# EAGLE design 8_button_harvester (EAGLE 9.5.1)

## Sheet 1 of 2
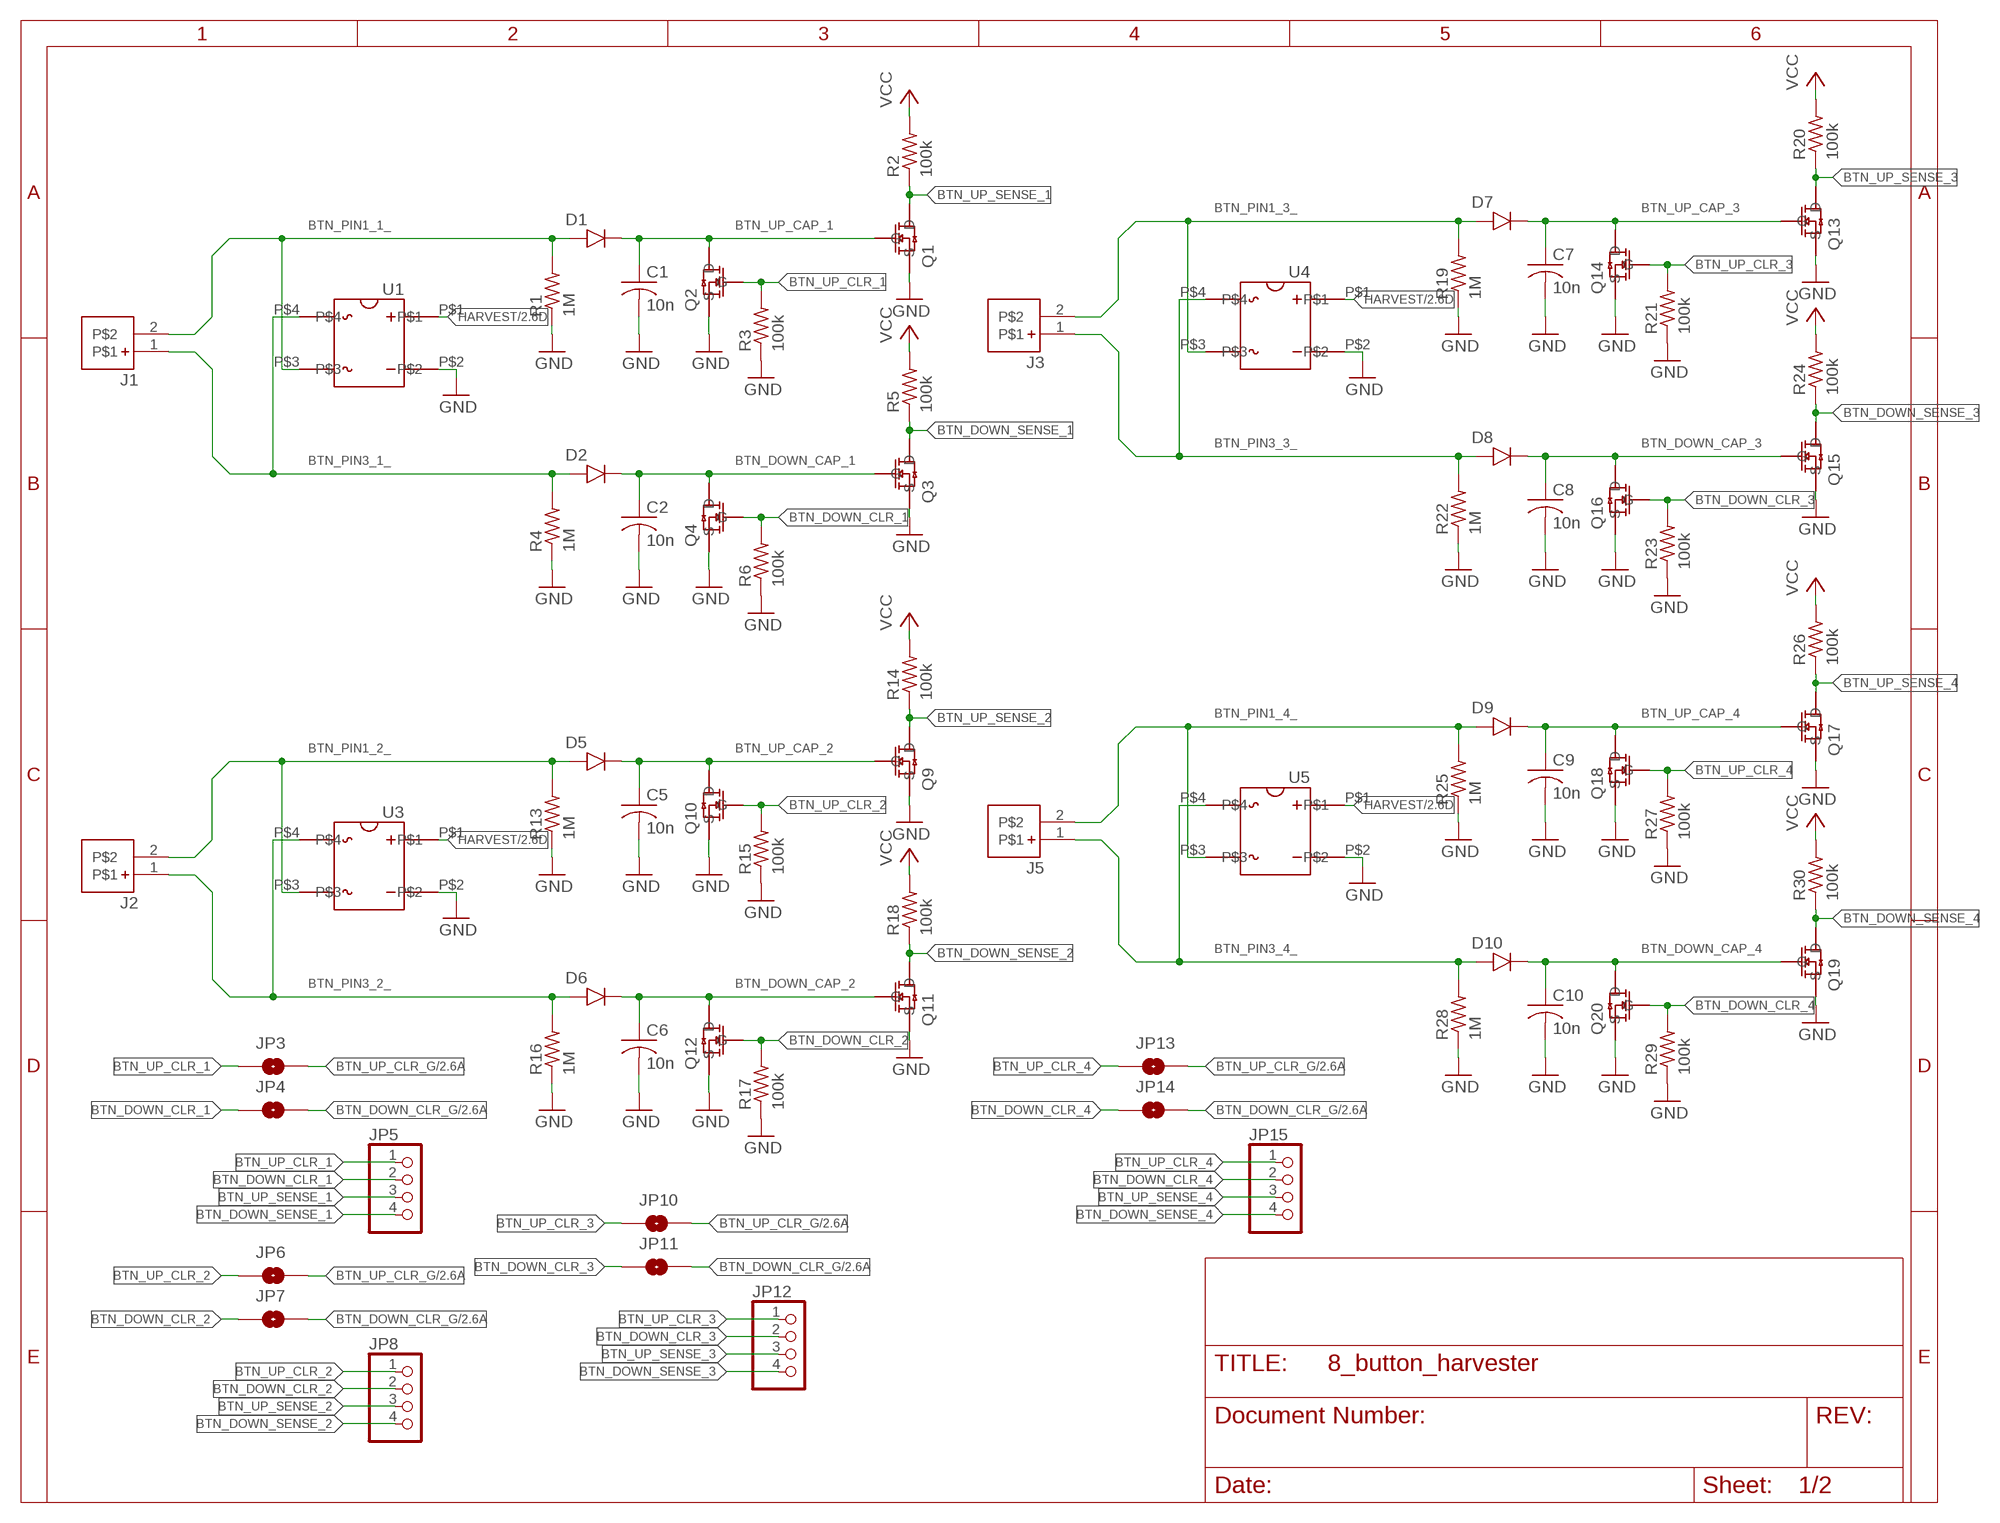
[diagram p0: schematic, sheet 1]

### Parts
C1  10n  C-USC0402  [C0402]
C2  10n  C-USC0402  [C0402]
C5  10n  C-USC0402  [C0402]
C6  10n  C-USC0402  [C0402]
C7  10n  C-USC0402  [C0402]
C8  10n  C-USC0402  [C0402]
C9  10n  C-USC0402  [C0402]
C10  10n  C-USC0402  [C0402]
D1  DFLU1200  [DFLU1200]
D2  DFLU1200  [DFLU1200]
D5  DFLU1200  [DFLU1200]
D6  DFLU1200  [DFLU1200]
D7  DFLU1200  [DFLU1200]
D8  DFLU1200  [DFLU1200]
D9  DFLU1200  [DFLU1200]
D10  DFLU1200  [DFLU1200]
J1  S2B-PH-SM4-TB  [S2B-PH-SM4-TB]
J2  S2B-PH-SM4-TB  [S2B-PH-SM4-TB]
J3  S2B-PH-SM4-TB  [S2B-PH-SM4-TB]
J5  S2B-PH-SM4-TB  [S2B-PH-SM4-TB]
JP3  JUMPER-SMT_2_NO_NO-SILK  [SMT-JUMPER_2_NO_NO-SILK]
JP4  JUMPER-SMT_2_NO_NO-SILK  [SMT-JUMPER_2_NO_NO-SILK]
JP5  PINHD-1X4  [1X04]
JP6  JUMPER-SMT_2_NO_NO-SILK  [SMT-JUMPER_2_NO_NO-SILK]
JP7  JUMPER-SMT_2_NO_NO-SILK  [SMT-JUMPER_2_NO_NO-SILK]
JP8  PINHD-1X4  [1X04]
JP10  JUMPER-SMT_2_NO_NO-SILK  [SMT-JUMPER_2_NO_NO-SILK]
JP11  JUMPER-SMT_2_NO_NO-SILK  [SMT-JUMPER_2_NO_NO-SILK]
JP12  PINHD-1X4  [1X04]
JP13  JUMPER-SMT_2_NO_NO-SILK  [SMT-JUMPER_2_NO_NO-SILK]
JP14  JUMPER-SMT_2_NO_NO-SILK  [SMT-JUMPER_2_NO_NO-SILK]
JP15  PINHD-1X4  [1X04]
Q1  2N7002K-7  [2N7002K-7]
Q2  BSS138K  [BSS138K]
Q3  2N7002K-7  [2N7002K-7]
Q4  BSS138K  [BSS138K]
Q9  2N7002K-7  [2N7002K-7]
Q10  BSS138K  [BSS138K]
Q11  2N7002K-7  [2N7002K-7]
Q12  BSS138K  [BSS138K]
Q13  2N7002K-7  [2N7002K-7]
Q14  BSS138K  [BSS138K]
Q15  2N7002K-7  [2N7002K-7]
Q16  BSS138K  [BSS138K]
Q17  2N7002K-7  [2N7002K-7]
Q18  BSS138K  [BSS138K]
Q19  2N7002K-7  [2N7002K-7]
Q20  BSS138K  [BSS138K]
R1  1M  R-US_R0402  [R0402]
R2  100k  R-US_R0402  [R0402]
R3  100k  R-US_R0402  [R0402]
R4  1M  R-US_R0402  [R0402]
R5  100k  R-US_R0402  [R0402]
R6  100k  R-US_R0402  [R0402]
R13  1M  R-US_R0402  [R0402]
R14  100k  R-US_R0402  [R0402]
R15  100k  R-US_R0402  [R0402]
R16  1M  R-US_R0402  [R0402]
R17  100k  R-US_R0402  [R0402]
R18  100k  R-US_R0402  [R0402]
R19  1M  R-US_R0402  [R0402]
R20  100k  R-US_R0402  [R0402]
R21  100k  R-US_R0402  [R0402]
R22  1M  R-US_R0402  [R0402]
R23  100k  R-US_R0402  [R0402]
R24  100k  R-US_R0402  [R0402]
R25  1M  R-US_R0402  [R0402]
R26  100k  R-US_R0402  [R0402]
R27  100k  R-US_R0402  [R0402]
R28  1M  R-US_R0402  [R0402]
R29  100k  R-US_R0402  [R0402]
R30  100k  R-US_R0402  [R0402]
U1  CDBHD140L-G  [CDBHDXX0L-G]
U3  CDBHD140L-G  [CDBHDXX0L-G]
U4  CDBHD140L-G  [CDBHDXX0L-G]
U5  CDBHD140L-G  [CDBHDXX0L-G]

### Nets
BTN_DOWN_CAP_1: C2.1 D2.K Q3.G Q4.D
BTN_DOWN_CAP_2: C6.1 D6.K Q11.G Q12.D
BTN_DOWN_CAP_3: C8.1 D8.K Q15.G Q16.D
BTN_DOWN_CAP_4: C10.1 D10.K Q19.G Q20.D
BTN_DOWN_CLR_1: JP4.1 JP5.2 Q4.G R6.2
BTN_DOWN_CLR_2: JP7.1 JP8.2 Q12.G R17.2
BTN_DOWN_CLR_3: JP11.1 JP12.2 Q16.G R23.2
BTN_DOWN_CLR_4: JP14.1 JP15.2 Q20.G R29.2
BTN_DOWN_CLR_G: JP4.2 JP7.2 JP11.2 JP14.2 ; also sheet 2
BTN_DOWN_SENSE_1: JP5.4 Q3.D R5.1
BTN_DOWN_SENSE_2: JP8.4 Q11.D R18.1
BTN_DOWN_SENSE_3: JP12.4 Q15.D R24.1
BTN_DOWN_SENSE_4: JP15.4 Q19.D R30.1
BTN_PIN1_1_: D1.A J1.2 R1.2 U1.P$3
BTN_PIN1_2_: D5.A J2.2 R13.2 U3.P$3
BTN_PIN1_3_: D7.A J3.2 R19.2 U4.P$3
BTN_PIN1_4_: D9.A J5.2 R25.2 U5.P$3
BTN_PIN3_1_: D2.A J1.1 R4.2 U1.P$4
BTN_PIN3_2_: D6.A J2.1 R16.2 U3.P$4
BTN_PIN3_3_: D8.A J3.1 R22.2 U4.P$4
BTN_PIN3_4_: D10.A J5.1 R28.2 U5.P$4
BTN_UP_CAP_1: C1.1 D1.K Q1.G Q2.D
BTN_UP_CAP_2: C5.1 D5.K Q9.G Q10.D
BTN_UP_CAP_3: C7.1 D7.K Q13.G Q14.D
BTN_UP_CAP_4: C9.1 D9.K Q17.G Q18.D
BTN_UP_CLR_1: JP3.1 JP5.1 Q2.G R3.2
BTN_UP_CLR_2: JP6.1 JP8.1 Q10.G R15.2
BTN_UP_CLR_3: JP10.1 JP12.1 Q14.G R21.2
BTN_UP_CLR_4: JP13.1 JP15.1 Q18.G R27.2
BTN_UP_CLR_G: JP3.2 JP6.2 JP10.2 JP13.2 ; also sheet 2
BTN_UP_SENSE_1: JP5.3 Q1.D R2.1
BTN_UP_SENSE_2: JP8.3 Q9.D R14.1
BTN_UP_SENSE_3: JP12.3 Q13.D R20.1
BTN_UP_SENSE_4: JP15.3 Q17.D R26.1
GND: C1.2 C2.2 C5.2 C6.2 C7.2 C8.2 C9.2 C10.2 Q1.S Q2.S Q3.S Q4.S Q9.S Q10.S Q11.S Q12.S Q13.S Q14.S Q15.S Q16.S Q17.S Q18.S Q19.S Q20.S R1.1 R3.1 R4.1 R6.1 R13.1 R15.1 R16.1 R17.1 R19.1 R21.1 R22.1 R23.1 R25.1 R27.1 R28.1 R29.1 U1.P$2 U3.P$2 U4.P$2 U5.P$2 ; also sheet 2
HARVEST: U1.P$1 U3.P$1 U4.P$1 U5.P$1 ; also sheet 2
VCC: R2.2 R5.2 R14.2 R18.2 R20.2 R24.2 R26.2 R30.2 ; also sheet 2

## Sheet 2 of 2
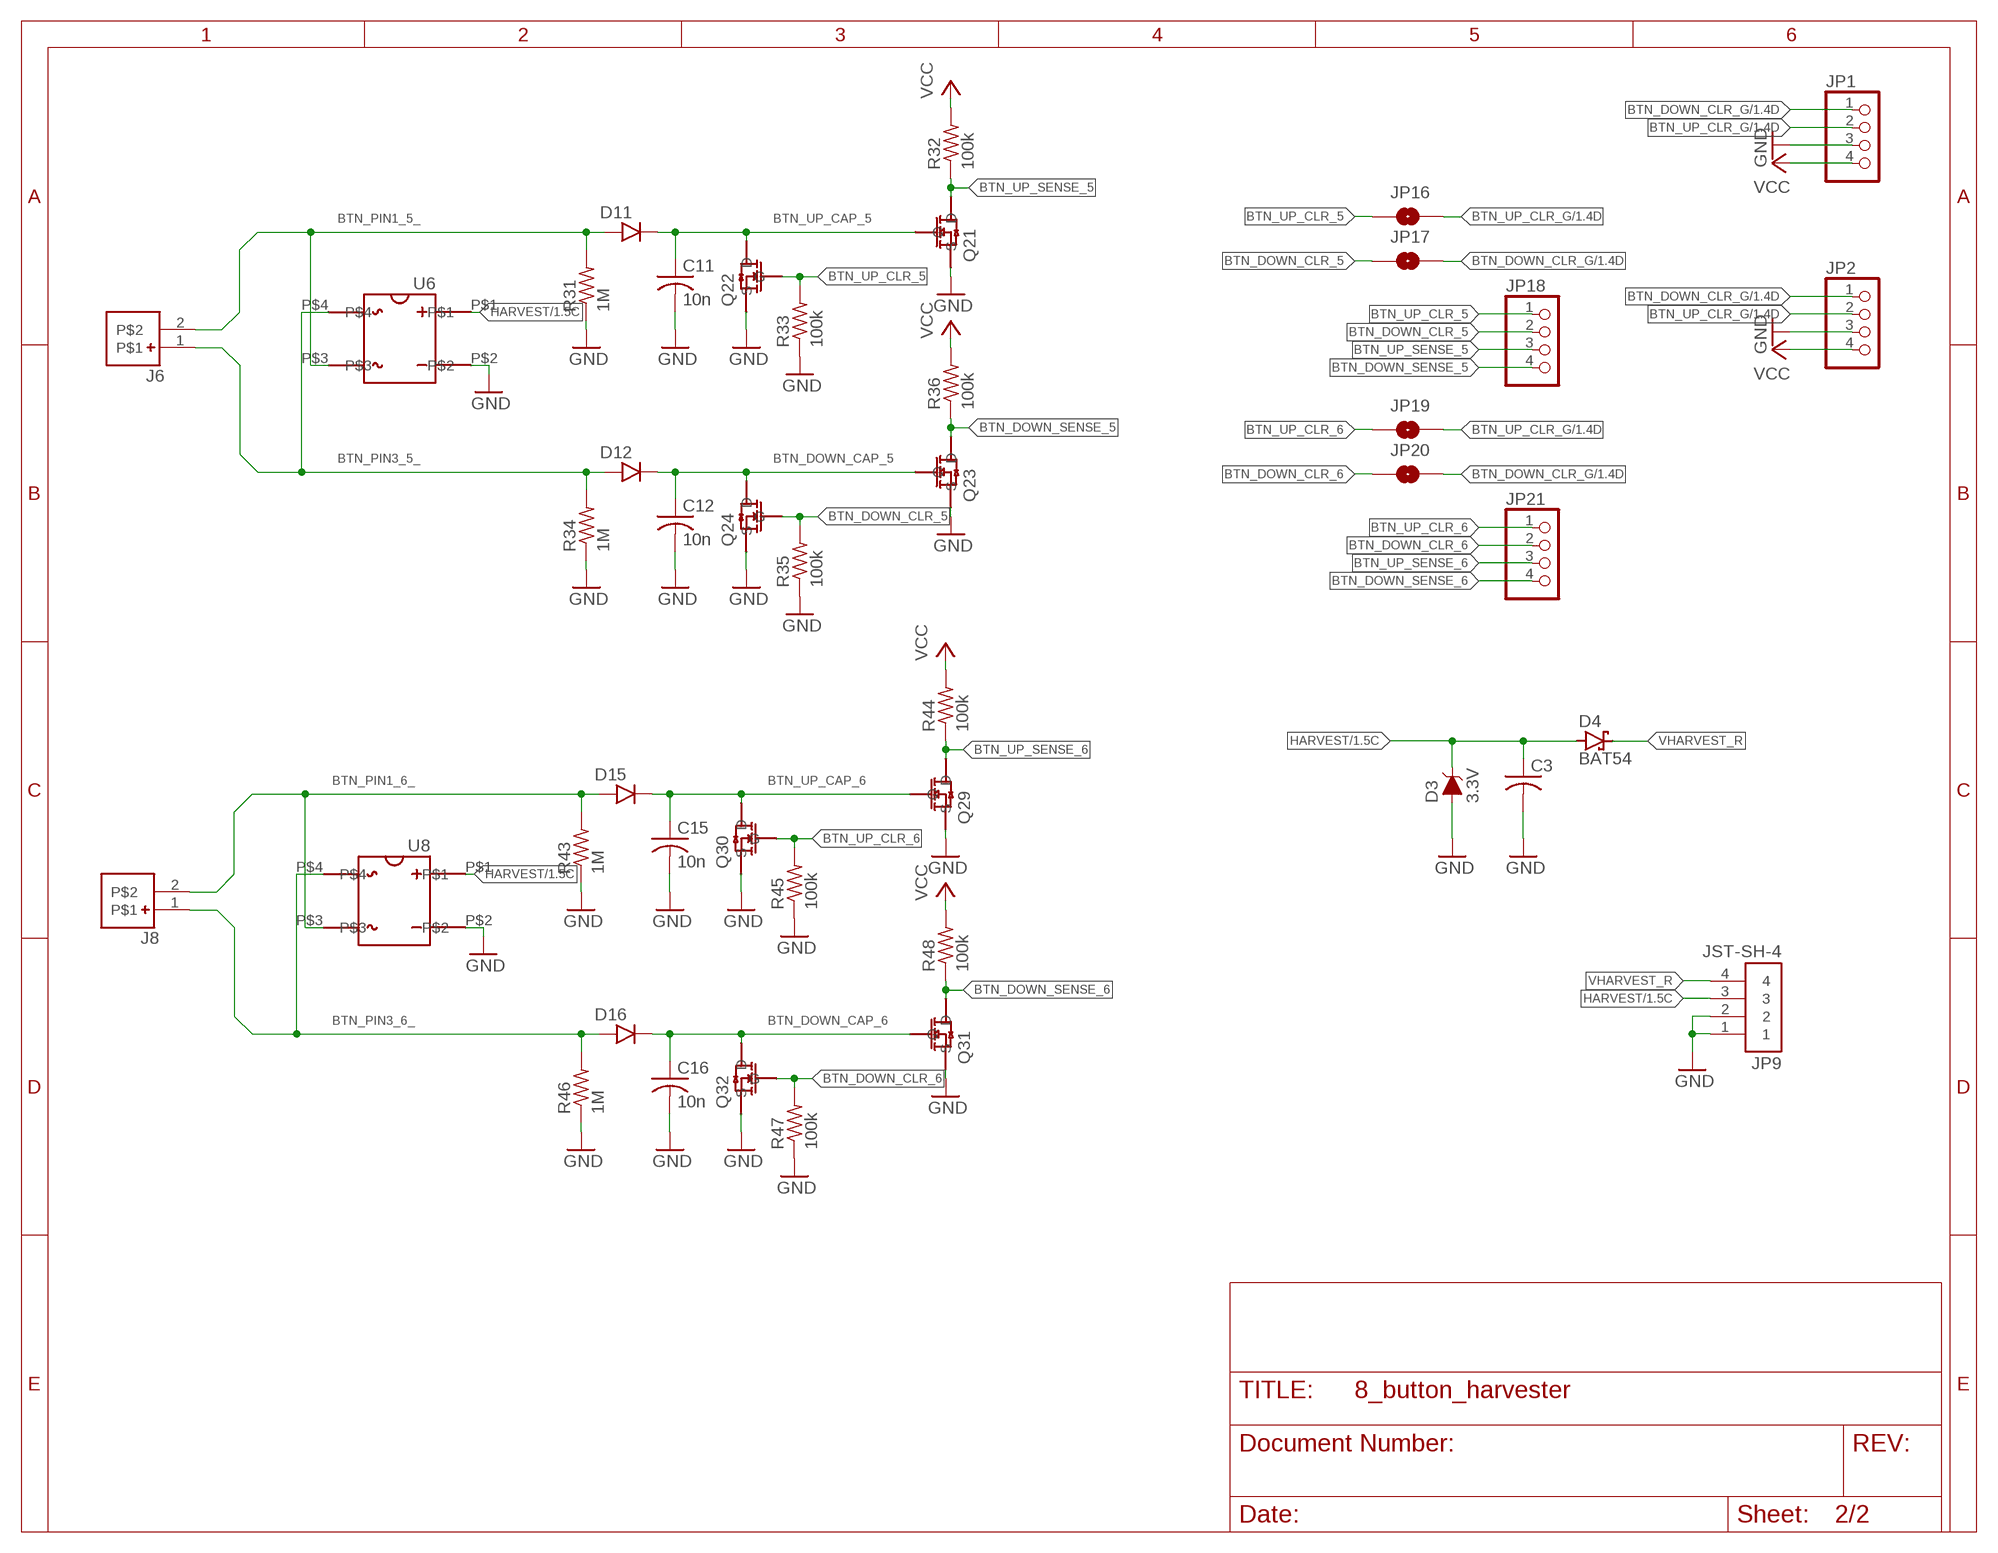
[diagram p1: schematic, sheet 2]

### Parts
C3  C-USC0805  [C0805]
C11  10n  C-USC0402  [C0402]
C12  10n  C-USC0402  [C0402]
C15  10n  C-USC0402  [C0402]
C16  10n  C-USC0402  [C0402]
D3  3.3V  DIODE-ZENER-MM3Z3V3T1G  [SOD-323]
D4  BAT54  [SOT23]
D11  DFLU1200  [DFLU1200]
D12  DFLU1200  [DFLU1200]
D15  DFLU1200  [DFLU1200]
D16  DFLU1200  [DFLU1200]
J6  S2B-PH-SM4-TB  [S2B-PH-SM4-TB]
J8  S2B-PH-SM4-TB  [S2B-PH-SM4-TB]
JP1  PINHD-1X4  [1X04]
JP2  PINHD-1X4  [1X04]
JP9  JST-SH-4  [JST-SH-4]
JP16  JUMPER-SMT_2_NO_NO-SILK  [SMT-JUMPER_2_NO_NO-SILK]
JP17  JUMPER-SMT_2_NO_NO-SILK  [SMT-JUMPER_2_NO_NO-SILK]
JP18  PINHD-1X4  [1X04]
JP19  JUMPER-SMT_2_NO_NO-SILK  [SMT-JUMPER_2_NO_NO-SILK]
JP20  JUMPER-SMT_2_NO_NO-SILK  [SMT-JUMPER_2_NO_NO-SILK]
JP21  PINHD-1X4  [1X04]
Q21  2N7002K-7  [2N7002K-7]
Q22  BSS138K  [BSS138K]
Q23  2N7002K-7  [2N7002K-7]
Q24  BSS138K  [BSS138K]
Q29  2N7002K-7  [2N7002K-7]
Q30  BSS138K  [BSS138K]
Q31  2N7002K-7  [2N7002K-7]
Q32  BSS138K  [BSS138K]
R31  1M  R-US_R0402  [R0402]
R32  100k  R-US_R0402  [R0402]
R33  100k  R-US_R0402  [R0402]
R34  1M  R-US_R0402  [R0402]
R35  100k  R-US_R0402  [R0402]
R36  100k  R-US_R0402  [R0402]
R43  1M  R-US_R0402  [R0402]
R44  100k  R-US_R0402  [R0402]
R45  100k  R-US_R0402  [R0402]
R46  1M  R-US_R0402  [R0402]
R47  100k  R-US_R0402  [R0402]
R48  100k  R-US_R0402  [R0402]
U6  CDBHD140L-G  [CDBHDXX0L-G]
U8  CDBHD140L-G  [CDBHDXX0L-G]

### Nets
BTN_DOWN_CAP_5: C12.1 D12.K Q23.G Q24.D
BTN_DOWN_CAP_6: C16.1 D16.K Q31.G Q32.D
BTN_DOWN_CLR_5: JP17.1 JP18.2 Q24.G R35.2
BTN_DOWN_CLR_6: JP20.1 JP21.2 Q32.G R47.2
BTN_DOWN_CLR_G: JP1.1 JP2.1 JP17.2 JP20.2 ; also sheet 1
BTN_DOWN_SENSE_5: JP18.4 Q23.D R36.1
BTN_DOWN_SENSE_6: JP21.4 Q31.D R48.1
BTN_PIN1_5_: D11.A J6.2 R31.2 U6.P$3
BTN_PIN1_6_: D15.A J8.2 R43.2 U8.P$3
BTN_PIN3_5_: D12.A J6.1 R34.2 U6.P$4
BTN_PIN3_6_: D16.A J8.1 R46.2 U8.P$4
BTN_UP_CAP_5: C11.1 D11.K Q21.G Q22.D
BTN_UP_CAP_6: C15.1 D15.K Q29.G Q30.D
BTN_UP_CLR_5: JP16.1 JP18.1 Q22.G R33.2
BTN_UP_CLR_6: JP19.1 JP21.1 Q30.G R45.2
BTN_UP_CLR_G: JP1.2 JP2.2 JP16.2 JP19.2 ; also sheet 1
BTN_UP_SENSE_5: JP18.3 Q21.D R32.1
BTN_UP_SENSE_6: JP21.3 Q29.D R44.1
GND: C3.2 C11.2 C12.2 C15.2 C16.2 D3.A JP1.3 JP2.3 JP9.1 JP9.2 Q21.S Q22.S Q23.S Q24.S Q29.S Q30.S Q31.S Q32.S R31.1 R33.1 R34.1 R35.1 R43.1 R45.1 R46.1 R47.1 U6.P$2 U8.P$2 ; also sheet 1
HARVEST: C3.1 D3.C D4.1(A) JP9.3 U6.P$1 U8.P$1 ; also sheet 1
VCC: JP1.4 JP2.4 R32.2 R36.2 R44.2 R48.2 ; also sheet 1
VHARVEST_R: D4.3(C) JP9.4

## Library data of the parts
C1-C3 C5-C12 C15 C16 = rcl:C-US: CAPACITOR, American symbol; SPICEPREFIX: C
D1 D2 D5-D12 D15 D16 = afig-0007:DFLU1200
D3 = SparkFun-DiscreteSemi:DIODE-ZENER: Zener Diode A Zener diode allows current to flow from its anode to its cathode like a normal semiconductor diode, but it also permits current to flow in the reverse direction when its "Zener voltage" is reached. - WIkipedia; PROD_ID: DIO-11284
D4 = diode:BAT54: Schottky Diodes Source: Fairchild .. BAT54.pdf
J1-J3 J5 J6 J8 = JST-PH:S2B-PH-SM4-TB
JP1 JP2 JP5 JP8 JP12 JP15 JP18 JP21 = pinhead:PINHD-1X4: PIN HEADER
JP3 JP4 JP6 JP7 JP10 JP11 JP13 JP14 JP16 JP17 JP19 JP20 = solder-jumper:JUMPER-SMT_2_NO: Normally open jumper This jumper has two pads in close proximity to each other. Apply solder to close the connection. Round pads are easier to solder for beginners, but are a lot larger. SparkFun Product that uses the round pads: SparkFun EL Sequencer <https://www.sparkfun.com/products/12781>
JP9 = jst-sh:JST-SH-4: JST-SH 4 pin connector
Q1 Q3 Q9 Q11 Q13 Q15 Q17 Q19 Q21 Q23 Q29 Q31 = afig-0007:2N7002K-7
Q2 Q4 Q10 Q12 Q14 Q16 Q18 Q20 Q22 Q24 Q30 Q32 = afig-0007:BSS138K
R1-R6 R13-R36 R43-R48 = rcl:R-US_: RESISTOR, American symbol; SPICEPREFIX: R
U1 U3-U6 U8 = afig-0007:CDBHD140L-G

## Board
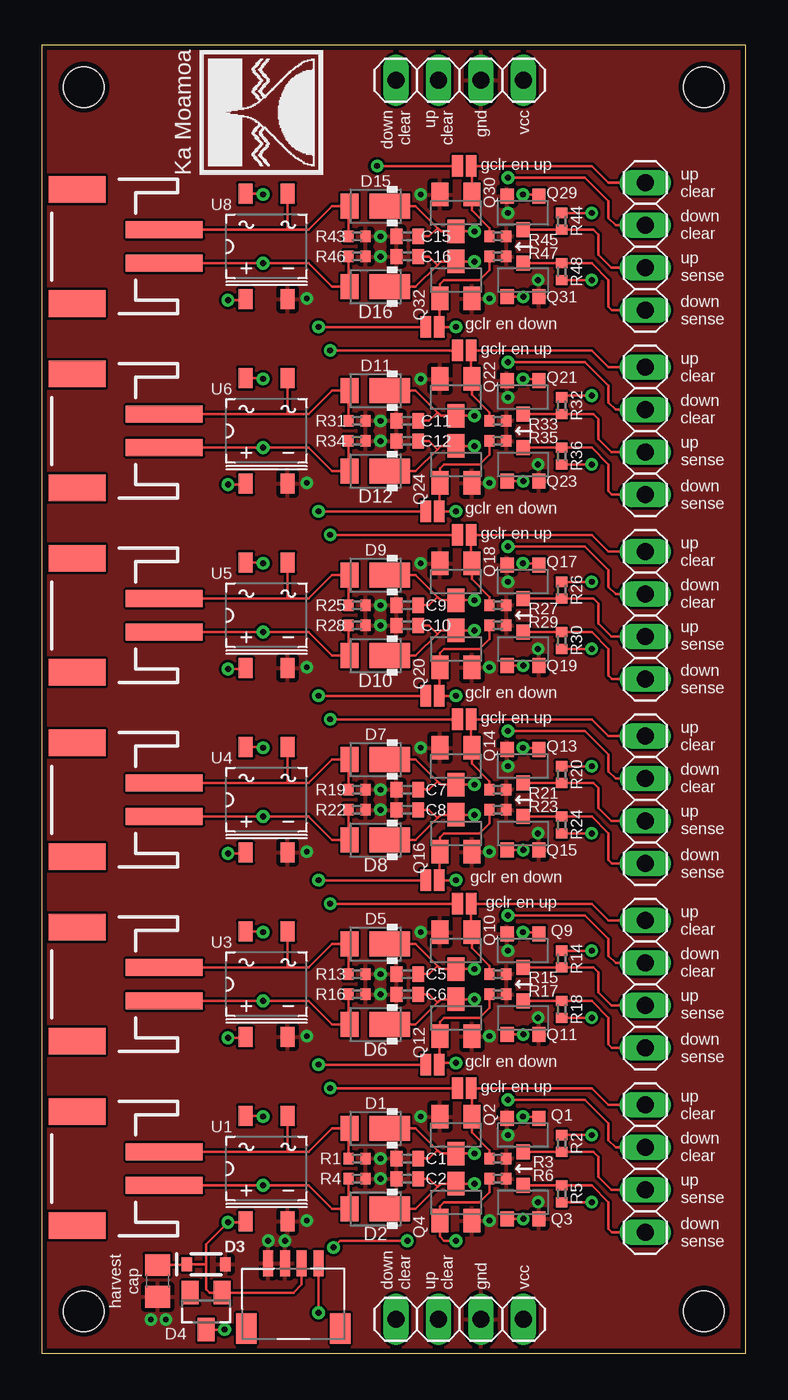
[diagram p2: board, top side]
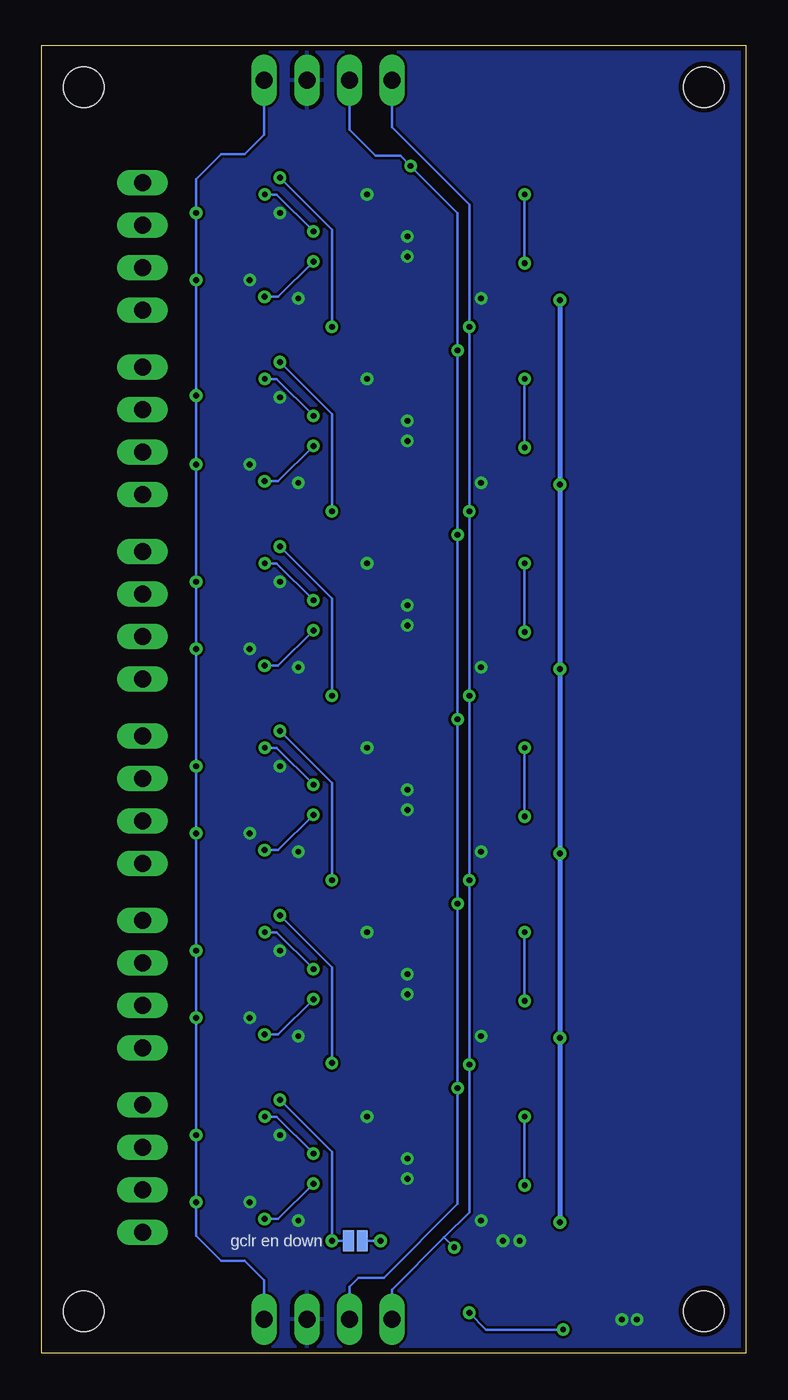
[diagram p3: board, bottom side, seen from below]

Size 42 x 78 mm. Coordinates in mm from the lower left corner, seen from the top.
Outline: 0,0 42,0 42,78 0,78 0,0
Copper layers (1*16): Top 0.035mm / dielectric 1.5mm / Bottom 0.035mm
Design rules "default *": minimum track width 6mil, minimum drill 0.35mm, track to track 6mil, track to pad 6mil, pad to pad 6mil, via to via 6mil, smd to smd 6mil, copper to edge 12mil, drill to drill 6mil, minimum pad ring 10mil, minimum via ring 8mil, stop-mask expansion 4mil, vias tented up to drill 0mil, thermal gap 10mil
Holes 2.4 mm at 2.5,2.5 39.5,2.5 2.5,75.5 39.5,75.5

### Footprints (pad centres in the part's own frame; a part is rotated, then mirrored left to right if it is on the bottom)
C0402 = smd 0.7 x 0.9: 1 -0.65,0; 2 0.65,0
C0805 = smd 1.3 x 1.5: 1 -0.95,0; 2 0.95,0
DFLU1200 = smd 1.05 x 1.5: A -1.55,0 | smd 2.4 x 1.5: K 0.85,0
SOD-323 = smd 0.63 x 0.83: A 1.15,0; C -1.15,0
SOT23 = smd 1 x 1.4: 1 -0.95,-1.1; 2 0.95,-1.1; 3 0,1.1
S2B-PH-SM4-TB = smd 1 x 4.6: 1 -1,-3.7; 2 1,-3.7 | smd 1.6 x 3.4: NC1 -3.4,1.5; NC2 3.4,1.5
1X04 = drill 1.016 long: 1 -3.81,0; 2 -1.27,0; 3 1.27,0; 4 3.81,0
SMT-JUMPER_2_NO_NO-SILK = smd 0.635 x 1.27: 1 -0.406,0; 2 0.406,0
JST-SH-4 = smd 0.6 x 1.55: 1 -1.5,2.34; 2 -0.5,2.34; 3 0.5,2.34; 4 1.5,2.34 | smd 1.2 x 1.8: P-MOUNT1 -2.8,-1.535; P-MOUNT2 2.8,-1.535
2N7002K-7 = smd 0.8 x 0.9: D 0,1; G -0.95,-1; S 0.95,-1
BSS138K = smd 1 x 1.4: D 0,1.1; G -0.95,-1.1; S 0.95,-1.1
R0402 = smd 0.6 x 0.7: 1 -0.5,0; 2 0.5,0
CDBHDXX0L-G = smd 0.85 x 1.2: P$1 1.25,3.15; P$2 -1.25,3.15; P$3 -1.25,-3.15; P$4 1.25,-3.15

### Placement (x,y rotation side)
C1  21.8,11.6 180 top
C2  21.8,10.4 180 top
C3  6.9,4.3 270 top
C5  21.8,22.6 180 top
C6  21.8,21.4 180 top
C7  21.8,33.6 180 top
C8  21.8,32.4 180 top
C9  21.8,44.6 180 top
C10  21.8,43.4 180 top
C11  21.8,55.6 180 top
C12  21.8,54.4 180 top
C15  21.8,66.6 180 top
C16  21.8,65.4 180 top
D1  19.9,13.4 0 top
D2  19.9,8.6 0 top
D3  9.8,5.3 0 top
D4  9.8,2.5 180 top
D5  19.9,24.4 0 top
D6  19.9,19.6 0 top
D7  19.9,35.4 0 top
D8  19.9,30.6 0 top
D9  19.9,46.4 0 top
D10  19.9,41.6 0 top
D11  19.9,57.4 0 top
D12  19.9,52.6 0 top
D15  19.9,68.4 0 top
D16  19.9,63.6 0 top
J1  3.6,11 90 top
J2  3.6,22 90 top
J3  3.6,33 90 top
J5  3.6,44 90 top
J6  3.6,55 90 top
J8  3.6,66 90 top
JP1  24.92,2.02 0 top
JP2  24.92,75.91 0 top
JP3  25.2,15.8 180 top
JP4  23.3,6.7 0 bottom
JP5  36,11 270 top
JP6  25.2,26.8 180 top
JP7  23.3,17.2 180 top
JP8  36,22 270 top
JP9  15,3 0 top
JP10  25.2,37.8 180 top
JP11  23.3,28.2 180 top
JP12  36,33 270 top
JP13  25.2,48.8 180 top
JP14  23.3,39.2 180 top
JP15  36,44 270 top
JP16  25.2,59.8 180 top
JP17  23.3,50.2 180 top
JP18  36,55 270 top
JP19  25.2,70.8 180 top
JP20  23.3,61.2 180 top
JP21  36,66 270 top
Q1  28.7,13 180 top
Q2  24.7,13 180 top
Q3  28.7,9 0 top
Q4  24.7,9 0 top
Q9  28.7,24 180 top
Q10  24.7,24 180 top
Q11  28.7,20 0 top
Q12  24.7,20 0 top
Q13  28.7,35 180 top
Q14  24.7,35 180 top
Q15  28.7,31 0 top
Q16  24.7,31 0 top
Q17  28.7,46 180 top
Q18  24.7,46 180 top
Q19  28.7,42 0 top
Q20  24.7,42 0 top
Q21  28.7,57 180 top
Q22  24.7,57 180 top
Q23  28.7,53 0 top
Q24  24.7,53 0 top
Q29  28.7,68 180 top
Q30  24.7,68 180 top
Q31  28.7,64 0 top
Q32  24.7,64 0 top
R1  18.8,11.6 180 top
R2  31,12.5 90 top
R3  27.2,11.6 180 top
R4  18.8,10.4 180 top
R5  31,9.5 270 top
R6  27.2,10.4 180 top
R13  18.8,22.6 180 top
R14  31,23.5 90 top
R15  27.2,22.6 180 top
R16  18.8,21.4 180 top
R17  27.2,21.4 180 top
R18  31,20.5 270 top
R19  18.8,33.6 180 top
R20  31,34.5 90 top
R21  27.2,33.6 180 top
R22  18.8,32.4 180 top
R23  27.2,32.4 180 top
R24  31,31.5 270 top
R25  18.8,44.6 180 top
R26  31,45.5 90 top
R27  27.2,44.6 180 top
R28  18.8,43.4 180 top
R29  27.2,43.4 180 top
R30  31,42.5 270 top
R31  18.8,55.6 180 top
R32  31,56.5 90 top
R33  27.2,55.6 180 top
R34  18.8,54.4 180 top
R35  27.2,54.4 180 top
R36  31,53.5 270 top
R43  18.8,66.6 180 top
R44  31,67.5 90 top
R45  27.2,66.6 180 top
R46  18.8,65.4 180 top
R47  27.2,65.4 180 top
R48  31,64.5 270 top
U1  13.4,11 180 top
U3  13.4,22 180 top
U4  13.4,33 180 top
U5  13.4,44 180 top
U6  13.4,55 180 top
U8  13.4,66 180 top

### Tracks (layer width: path | path; a pad name or v marks a point on that pad's centre or on a via)
BTN_DOWN_CAP_1  (via drill 0.35)
  Top 0.152: D2.K 22.3,8.6 23.6,9.9 | 23.6,9.9 23.8,10.1 Q4.D v25.8,10.1 | C2.1 23.1,10.4 23.6,9.9 | v28.72,8 Q3.G
  Bottom 0.152: v25.8,10.1 27.9,8 v28.72,8
BTN_DOWN_CAP_2  (via drill 0.35)
  Top 0.152: D6.K 22.3,19.6 23.6,20.9 | 23.6,20.9 23.8,21.1 Q12.D v25.8,21.1 | C6.1 23.1,21.4 23.6,20.9 | v28.72,19 Q11.G
  Bottom 0.152: v25.8,21.1 27.9,19 v28.72,19
BTN_DOWN_CAP_3  (via drill 0.35)
  Top 0.152: D8.K 22.3,30.6 23.6,31.9 | 23.6,31.9 23.8,32.1 Q16.D v25.8,32.1 | C8.1 23.1,32.4 23.6,31.9 | v28.72,30 Q15.G
  Bottom 0.152: v25.8,32.1 27.9,30 v28.72,30
BTN_DOWN_CAP_4  (via drill 0.35)
  Top 0.152: D10.K 22.3,41.6 23.6,42.9 | 23.6,42.9 23.8,43.1 Q20.D v25.8,43.1 | C10.1 23.1,43.4 23.6,42.9 | v28.72,41 Q19.G
  Bottom 0.152: v25.8,43.1 27.9,41 v28.72,41
BTN_DOWN_CAP_5  (via drill 0.35)
  Top 0.152: D12.K 22.3,52.6 23.6,53.9 | 23.6,53.9 23.8,54.1 Q24.D v25.8,54.1 | C12.1 23.1,54.4 23.6,53.9 | v28.72,52 Q23.G
  Bottom 0.152: v25.8,54.1 27.9,52 v28.72,52
BTN_DOWN_CAP_6  (via drill 0.35)
  Top 0.152: D16.K 22.3,63.6 23.6,64.9 | 23.6,64.9 23.8,65.1 Q32.D v25.8,65.1 | C16.1 23.1,65.4 23.6,64.9 | v28.72,63 Q31.G
  Bottom 0.152: v25.8,65.1 27.9,63 v28.72,63
BTN_DOWN_CLR_1  (via drill 0.35)
  Top 0.152: R6.2 26.7,9.6 26.1,9 24,9 23.75,8.75 Q4.G 23.75,6.95 24,6.7 v24.7,6.7 | v27.8,15.1 32.4,15.1 33.8,13.7 33.8,12.7 34.23,12.27 JP5.2
  Bottom 0.152: JP4.1 v24.7,6.7 24.7,12 v27.8,15.1
BTN_DOWN_CLR_2  (via drill 0.35)
  Top 0.152: R17.2 26.7,20.6 26.1,20 24,20 23.75,19.75 Q12.G 23.71,18.86 JP7.1 23.81,17.3 v24.7,17.3 | v27.8,26.1 32.4,26.1 33.8,24.7 33.8,23.7 34.23,23.27 JP8.2
  Bottom 0.152: v24.7,17.3 24.7,23 v27.8,26.1
BTN_DOWN_CLR_3  (via drill 0.35)
  Top 0.152: R23.2 26.7,31.6 26.1,31 24,31 23.75,30.75 Q16.G 23.71,29.86 JP11.1 v24.7,28.2 | JP12.2 34.23,34.27 33.8,34.7 33.8,35.7 32.4,37.1 v27.8,37.1
  Bottom 0.152: v24.7,28.2 24.7,34 v27.8,37.1
BTN_DOWN_CLR_4  (via drill 0.35)
  Top 0.152: R29.2 26.7,42.6 26.1,42 24,42 23.75,41.75 Q20.G 23.71,40.86 JP14.1 v24.7,39.2 | JP15.2 34.23,45.27 33.8,45.7 33.8,46.7 32.4,48.1 v27.8,48.1
  Bottom 0.152: v24.7,39.2 24.7,45 v27.8,48.1
BTN_DOWN_CLR_5  (via drill 0.35)
  Top 0.152: R35.2 26.7,53.6 26.1,53 24,53 23.75,52.75 Q24.G 23.71,51.86 JP17.1 v24.7,50.2 | v27.8,59.1 32.4,59.1 33.8,57.7 33.8,56.7 34.23,56.27 JP18.2
  Bottom 0.152: v24.7,50.2 24.7,56 v27.8,59.1
BTN_DOWN_CLR_6  (via drill 0.35)
  Top 0.152: R47.2 26.7,64.6 26.1,64 24,64 23.75,63.75 Q32.G 23.71,62.86 JP20.1 v24.7,61.2 | v27.8,70.1 32.4,70.1 33.8,68.7 33.8,67.7 34.23,67.27 JP21.2
  Bottom 0.152: v24.7,61.2 24.7,67 v27.8,70.1
BTN_DOWN_CLR_G  (via drill 0.35)
  Top 0.152: JP7.2 v16.5,17.2 | v17.4,6.3 17.8,6.7 v21.8,6.7 | JP11.2 v16.5,28.2 | JP14.2 v16.5,39.2 | JP17.2 v16.5,50.2 | JP20.2 v16.5,61.2
  Bottom 0.152: JP1.1 21.11,3.79 18,6.9 | 18,6.9 16.5,8.4 v16.5,17.2 v16.5,28.2 v16.5,39.2 v16.5,50.2 v16.5,61.2 16.5,68.5 21.11,73.11 JP2.1 | JP4.2 v21.8,6.7 | v17.4,6.3 18,6.9
BTN_DOWN_SENSE_1
  Top 0.152: Q3.D R5.1 32.8,10 33.8,9 33.8,7.4 34,7.2 JP5.4
BTN_DOWN_SENSE_2
  Top 0.152: Q11.D R18.1 32.8,21 33.8,20 33.8,18.4 34.01,18.19 JP8.4
BTN_DOWN_SENSE_3
  Top 0.152: Q15.D R24.1 32.8,32 33.8,31 33.8,29.4 34.01,29.19 JP12.4
BTN_DOWN_SENSE_4
  Top 0.152: Q19.D R30.1 32.8,43 33.8,42 33.8,40.4 34.01,40.19 JP15.4
BTN_DOWN_SENSE_5
  Top 0.152: Q23.D R36.1 32.8,54 33.8,53 33.8,51.4 34.01,51.19 JP18.4
BTN_DOWN_SENSE_6
  Top 0.152: Q31.D R48.1 32.8,65 33.8,64 33.8,62.4 34.01,62.19 JP21.4
BTN_PIN1_1_
  Top 0.152: R1.2 18.3,13.35 D1.A 17.3,13.4 15.9,12 14.6,12 | J1.2 14.6,12 | 14.6,12 14.65,12.05 U1.P$3
BTN_PIN1_2_
  Top 0.152: R13.2 18.3,24.35 D5.A 17.3,24.4 15.9,23 14.6,23 | J2.2 14.6,23 | 14.6,23 14.65,23.05 U3.P$3
BTN_PIN1_3_
  Top 0.152: R19.2 18.3,35.35 D7.A 17.3,35.4 15.9,34 14.6,34 | J3.2 14.6,34 | 14.6,34 14.65,34.05 U4.P$3
BTN_PIN1_4_
  Top 0.152: R25.2 18.3,46.35 D9.A 17.3,46.4 15.9,45 14.6,45 | J5.2 14.6,45 | 14.6,45 14.65,45.05 U5.P$3
BTN_PIN1_5_
  Top 0.152: R31.2 18.3,57.35 D11.A 17.3,57.4 15.9,56 14.6,56 | J6.2 14.6,56 | 14.6,56 14.65,56.05 U6.P$3
BTN_PIN1_6_
  Top 0.152: R43.2 18.3,68.35 D15.A 17.3,68.4 15.9,67 14.6,67 | J8.2 14.6,67 | 14.6,67 14.65,67.05 U8.P$3
BTN_PIN3_1_  (via drill 0.35)
  Top 0.152: R4.2 18.3,8.65 D2.A 17.3,8.6 15.9,10 v13.2,10 J1.1 | U1.P$4 13.15,14.15 v13.2,14.1
  Bottom 0.152: v13.2,10 v13.2,14.1
BTN_PIN3_2_  (via drill 0.35)
  Top 0.152: R16.2 18.3,19.65 D6.A 17.3,19.6 15.9,21 v13.2,21 J2.1 | U3.P$4 13.15,25.15 v13.2,25.1
  Bottom 0.152: v13.2,21 v13.2,25.1
BTN_PIN3_3_  (via drill 0.35)
  Top 0.152: R22.2 18.3,30.65 D8.A 17.3,30.6 15.9,32 v13.2,32 J3.1 | U4.P$4 13.15,36.15 v13.2,36.1
  Bottom 0.152: v13.2,32 v13.2,36.1
BTN_PIN3_4_  (via drill 0.35)
  Top 0.152: R28.2 18.3,41.65 D10.A 17.3,41.6 15.9,43 v13.2,43 J5.1 | U5.P$4 13.15,47.15 v13.2,47.1
  Bottom 0.152: v13.2,43 v13.2,47.1
BTN_PIN3_5_  (via drill 0.35)
  Top 0.152: R34.2 18.3,52.65 D12.A 17.3,52.6 15.9,54 v13.2,54 J6.1 | U6.P$4 13.15,58.15 v13.2,58.1
  Bottom 0.152: v13.2,54 v13.2,58.1
BTN_PIN3_6_  (via drill 0.35)
  Top 0.152: R46.2 18.3,63.65 D16.A 17.3,63.6 15.9,65 v13.2,65 J8.1 | U8.P$4 13.15,69.15 v13.2,69.1
  Bottom 0.152: v13.2,65 v13.2,69.1
BTN_UP_CAP_1  (via drill 0.35)
  Top 0.152: D1.K 22.3,13.4 23.6,12.1 | 23.6,12.1 23.8,11.9 Q2.D v25.8,11.9 | C1.1 23.1,11.6 23.6,12.1 | Q1.G 29.55,14.1 v28.7,14.1
  Bottom 0.152: v25.8,11.9 28,14.1 v28.7,14.1
BTN_UP_CAP_2  (via drill 0.35)
  Top 0.152: D5.K 22.3,24.4 23.6,23.1 | 23.6,23.1 23.8,22.9 Q10.D v25.8,22.9 | C5.1 23.1,22.6 23.6,23.1 | Q9.G 29.55,25.1 v28.7,25.1
  Bottom 0.152: v25.8,22.9 28,25.1 v28.7,25.1
BTN_UP_CAP_3  (via drill 0.35)
  Top 0.152: D7.K 22.3,35.4 23.6,34.1 | 23.6,34.1 23.8,33.9 Q14.D v25.8,33.9 | C7.1 23.1,33.6 23.6,34.1 | Q13.G 29.55,36.1 v28.7,36.1
  Bottom 0.152: v25.8,33.9 28,36.1 v28.7,36.1
BTN_UP_CAP_4  (via drill 0.35)
  Top 0.152: D9.K 22.3,46.4 23.6,45.1 | 23.6,45.1 23.8,44.9 Q18.D v25.8,44.9 | C9.1 23.1,44.6 23.6,45.1 | Q17.G 29.55,47.1 v28.7,47.1
  Bottom 0.152: v25.8,44.9 28,47.1 v28.7,47.1
BTN_UP_CAP_5  (via drill 0.35)
  Top 0.152: D11.K 22.3,57.4 23.6,56.1 | 23.6,56.1 23.8,55.9 Q22.D v25.8,55.9 | C11.1 23.1,55.6 23.6,56.1 | Q21.G 29.55,58.1 v28.7,58.1
  Bottom 0.152: v25.8,55.9 28,58.1 v28.7,58.1
BTN_UP_CAP_6  (via drill 0.35)
  Top 0.152: D15.K 22.3,68.4 23.6,67.1 | 23.6,67.1 23.8,66.9 Q30.D v25.8,66.9 | C15.1 23.1,66.6 23.6,67.1 | Q29.G 29.55,69.1 v28.7,69.1
  Bottom 0.152: v25.8,66.9 28,69.1 v28.7,69.1
BTN_UP_CLR_1
  Top 0.152: R3.2 26.7,12.1 25.65,13.15 Q2.G 25.65,15.76 JP3.1 32.8,15.8 33.8,14.8 JP5.1
BTN_UP_CLR_2
  Top 0.152: R15.2 26.7,23.1 25.65,24.15 Q10.G 25.61,25.14 JP6.1 32.8,26.8 33.8,25.8 JP8.1
BTN_UP_CLR_3
  Top 0.152: R21.2 26.7,34.1 25.65,35.15 Q14.G 25.61,36.14 JP10.1 32.8,37.8 33.8,36.8 JP12.1
BTN_UP_CLR_4
  Top 0.152: R27.2 26.7,45.1 25.65,46.15 Q18.G 25.61,47.14 JP13.1 32.8,48.8 33.79,47.81 JP15.1
BTN_UP_CLR_5
  Top 0.152: R33.2 26.7,56.1 25.65,57.15 25.65,58 | 25.65,58 Q22.G | 25.65,58 25.61,58.04 JP16.1 32.8,59.8 33.79,58.81 JP18.1
BTN_UP_CLR_6
  Top 0.152: R45.2 26.7,67.1 25.65,68.15 Q30.G 25.65,70.76 JP19.1 32.8,70.8 33.8,69.8 33.81,69.81 JP21.1
BTN_UP_CLR_G  (via drill 0.35)
  Top 0.152: JP3.2 v17.2,15.8 | JP6.2 v17.2,26.8 | JP19.2 v20,70.8 | JP16.2 v17.2,59.8 | JP13.2 v17.2,48.8 | JP10.2 v17.2,37.8
  Bottom 0.152: JP1.2 23.65,3.95 23.1,4.5 21.6,4.5 17.2,8.9 v17.2,15.8 v17.2,26.8 v17.2,37.8 v17.2,48.8 v17.2,59.8 17.2,68 v20,70.8 20.6,71.4 22.1,71.4 23.65,72.95 JP2.2
BTN_UP_SENSE_1
  Top 0.152: Q1.D R2.1 32.9,12 33.2,11.7 33.2,10.5 33.97,9.73 JP5.3
BTN_UP_SENSE_2
  Top 0.152: Q9.D R14.1 32.9,23 33.2,22.7 33.2,21.5 33.97,20.73 JP8.3
BTN_UP_SENSE_3
  Top 0.152: Q13.D R20.1 32.9,34 33.2,33.7 33.2,32.5 33.97,31.73 JP12.3
BTN_UP_SENSE_4
  Top 0.152: Q17.D R26.1 32.9,45 33.2,44.7 33.2,43.5 33.97,42.73 JP15.3
BTN_UP_SENSE_5
  Top 0.152: Q21.D R32.1 32.9,56 33.2,55.7 33.2,54.5 33.97,53.73 JP18.3
BTN_UP_SENSE_6
  Top 0.152: Q29.D R44.1 32.9,67 33.2,66.7 33.2,65.5 33.97,64.73 JP21.3
GND  (via drill 0.35)
  other vias: 27.8,13 29.6,9 26.7,7.9 22.6,14.1 20.2,10.4 20.2,11.6 15.8,7.9 27.8,24 29.6,20 26.7,18.9 22.6,25.1 20.2,21.4 20.2,22.6 15.8,18.9 27.8,35 29.6,31 26.7,29.9 22.6,36.1 20.2,32.4 20.2,33.6 15.8,29.9 27.8,46 29.6,42 26.7,40.9 22.6,47.1 20.2,43.4 20.2,44.6 15.8,40.9 27.8,57 29.6,53 26.7,51.9 22.6,58.1 20.2,54.4 20.2,55.6 15.8,51.9 27.8,68 29.6,64 26.7,62.9 22.6,69.1 20.2,65.4 20.2,66.6 15.8,62.9 6.5,2 7.4,2 13.5,6.7 14.5,6.7
  pour Top: 0,78 42,78 42,0 0,0
  pour Bottom: 0,78 42,78 42,0 0,0
HARVEST  (via drill 0.35)
  Top 0.152: v11.1,62.8 12.1,62.8 U8.P$1 | U1.P$1 12.1,7.8 v11.1,7.8 9.8,6.5 9.8,5.3 | U3.P$1 12.1,18.8 v11.1,18.8 | U4.P$1 12.1,29.8 v11.1,29.8 | U5.P$1 12.1,40.8 v11.1,40.8 | U6.P$1 12.1,51.8 v11.1,51.8 | C3.1 8.6,5.25 D3.C 9.8,5.3 | 9.8,5.3 9.8,3.8 10,3.6 D4.1 15,3.6 15.5,4.1 JP9.3
  Bottom 0.305: v11.1,62.8 v11.1,51.8 v11.1,40.8 v11.1,29.8 v11.1,18.8 v11.1,7.8
VCC  (via drill 0.35)
  Top 0.152: R44.2 v32.8,68 | R24.2 v32.8,31 | R20.2 v32.8,35 | R2.2 v32.8,13 | R18.2 v32.8,20 | R14.2 v32.8,24 | R30.2 v32.8,42 | R26.2 v32.8,46 | R32.2 31.1,57.1 v32.8,57.1 | R36.2 v32.8,53 | R48.2 v32.8,64 | R5.2 v32.8,9
  Bottom 0.152: JP1.4 28.73,4.33 29.9,5.5 31.3,5.5 32.8,7 v32.8,9 v32.8,13 v32.8,20 v32.8,24 v32.8,31 v32.8,35 v32.8,42 v32.8,46 v32.8,53 v32.8,57.1 v32.8,64 v32.8,68 32.8,70 31.3,71.5 29.9,71.5 28.73,72.67 JP2.4
VHARVEST_R  (via drill 0.35)
  Top 0.152: D4.3 v10.9,1.4 | v16.5,2.4 JP9.4
  Bottom 0.152: v10.9,1.4 15.5,1.4 v16.5,2.4

### Text on the board
tPlace: Ka Moamoa | down / clear | up / clear | gnd | vcc | gclr en up | up / clear | down / clear | up / sense | down / sense | gclr en down | gclr en up | up / clear | down / clear | up / sense | down / sense | gclr en down | gclr en up | up / clear | down / clear | up / sense | down / sense | gclr en down | gclr en up | up / clear | down / clear | up / sense | down / sense | gclr en down | gclr en up | up / clear | down / clear | up / sense | down / sense | gclr en down | gclr en up | up / clear | down / clear | up / sense | down / sense | harvest / cap | down / clear | up / clear | gnd | vcc
bPlace: gclr en down